# EAGLE design Side_LongE (EAGLE 9.4.2)
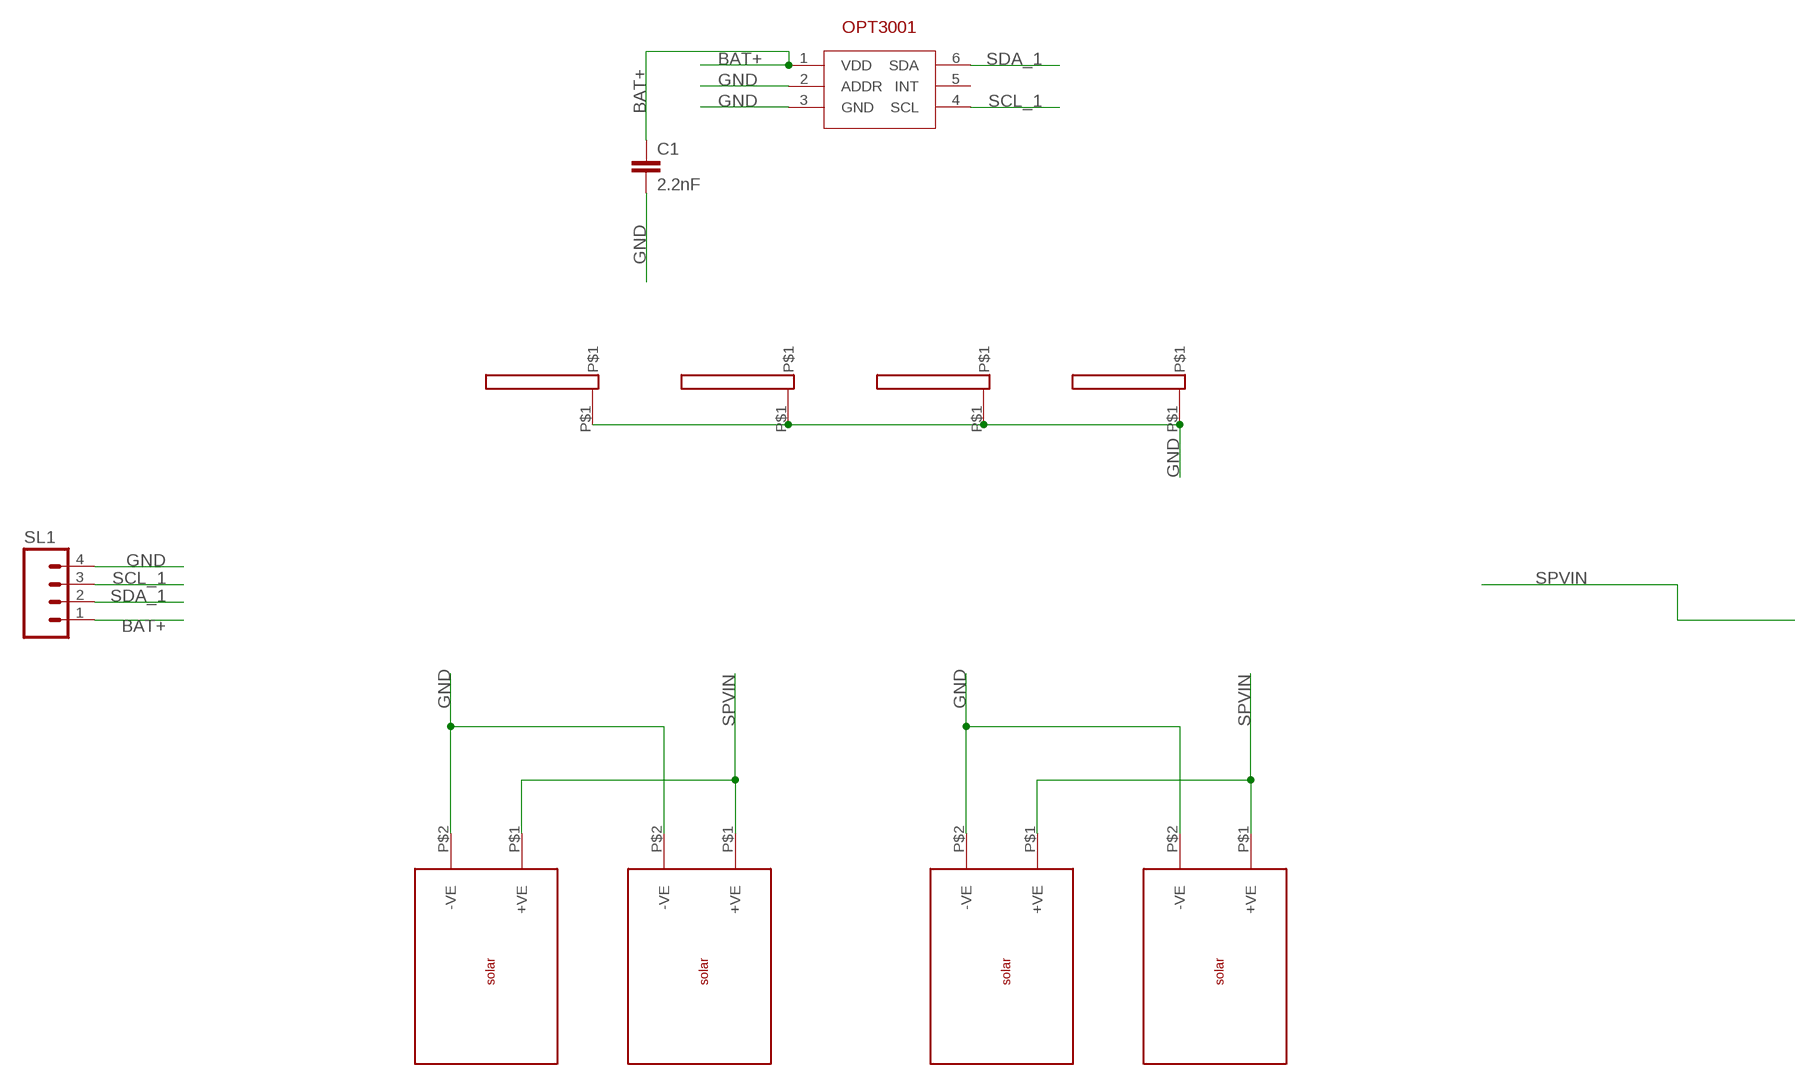
[diagram p0: schematic, sheet 1, part 1 of 2]
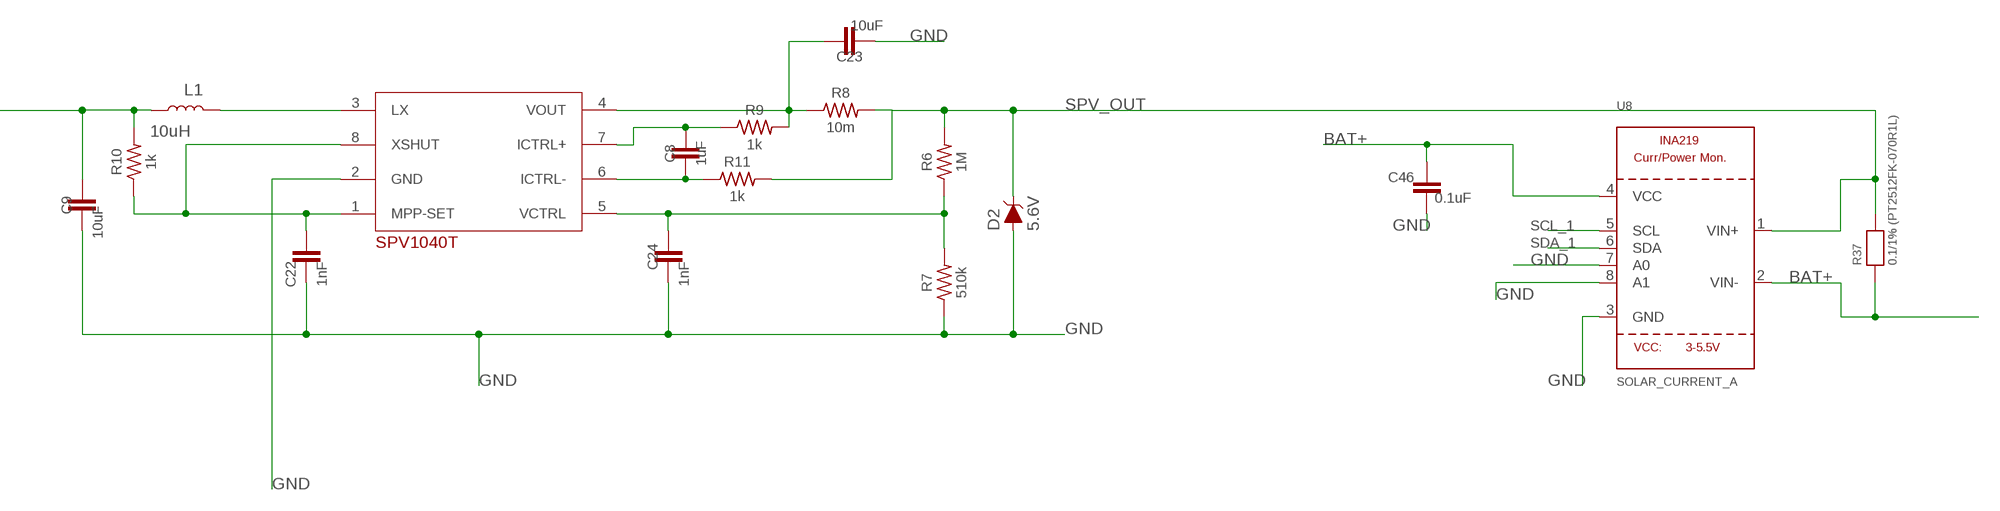
[diagram p1: schematic, sheet 1, part 2 of 2]

## Parts
C1  2.2nF  2.2NF/2200PF-0603-50V-10%  [0603]
C8  1uF  10UF-0603-6.3V-20%  [0603]
C9  10uF  10UF-0603-6.3V-20%  [0603]
C22  1nF  10UF-0603-6.3V-20%  [0603]
C23  10uF  10UF-0603-6.3V-20%  [0603]
C24  1nF  10UF-0603-6.3V-20%  [0603]
C46  0.1uF  10UF-0603-6.3V-20%  [0603]
D2  5.6V  DIODE-ZENER-MMSZ5232BS  [SOD-323]
L1  10uH  INDUCTOR-0603-33NH  [0603]
R6  1M  RC0603JR-070RL  [RES_0603]
R7  510k  RC0603JR-070RL  [RES_0603]
R8  10m  RC0603JR-070RL  [RES_0603]
R9  1k  RC0603JR-070RL  [RES_0603]
R10  1k  RC0603JR-070RL  [RES_0603]
R11  1k  RC0603JR-070RL  [RES_0603]
R37  0.1/1% (PT2512FK-070R1L)  RESISTOR2512  [2512]
SL1  M04  [04P]
SPV_A  SPV1040T_  [SOP65P640X120-8N]
U1  SON65P200X200X65-7N  [SON65P200X200X65-7N]
U8  SOLAR_CURRENT_A  INA219  [SOT23-8]
U$1  SOLAR_50_5_2  [FOOT]
U$2  SOLAR_50_5_2  [FOOT]
U$3  16X2  [16X2]
U$4  16X2  [16X2]
U$5  16X2  [16X2]
U$6  16X2  [16X2]
U$7  SOLAR_50_5_2  [FOOT]
U$8  SOLAR_50_5_2  [FOOT]

## Nets
BAT+: C1.1 C46.1 R37.1 SL1.1 U1.1(VDD) U8.2(VIN-) U8.4(VCC)
GND [vcc]: C1.2 C9.2 C22.2 C23.2 C24.2 C46.2 D2.A R7.1 SL1.4 SPV_A.2(GND) U1.2(ADDR) U1.3(GND) U8.3(GND) U8.7(A0) U8.8(A1) U$1.P$2(-VE) U$2.P$2(-VE) U$3.P$1 U$4.P$1 U$5.P$1 U$6.P$1 U$7.P$2(-VE) U$8.P$2(-VE)
N$5: L1.2 SPV_A.3(LX)
N$31: C22.1 R10.1 SPV_A.1(MPP-SET) SPV_A.8(XSHUT)
N$32: C24.1 R6.1 R7.2 SPV_A.5(VCTRL)
N$34: C8.2 R11.1 SPV_A.6(ICTRL-)
N$35: C8.1 R9.1 SPV_A.7(ICTRL+)
N$36: C23.1 R8.1 R9.2 SPV_A.4(VOUT)
SCL_1: SL1.3 U1.4(SCL) U8.5(SCL)
SDA_1: SL1.2 U1.6(SDA) U8.6(SDA)
SPV_OUT: D2.C R6.2 R8.2 R11.2 R37.2 U8.1(VIN+)
SPVIN: C9.1 L1.1 R10.2 U$1.P$1(+VE) U$2.P$1(+VE) U$7.P$1(+VE) U$8.P$1(+VE)
Unconnected: U1.5(INT)

## Library data of the parts
C1 = SparkFun-Capacitors:2.2NF/2200PF: 2.2nF/2,200pF ceramic capacitors A capacitor is a passive two-terminal electrical component used to store electrical energy temporarily in an electric field.; PROD_ID: CAP-07877
C8 C22 C24 C46 = SparkFun-Capacitors:10UF: 10.0µF ceramic capacitors A capacitor is a passive two-terminal electrical component used to store electrical energy temporarily in an electric field.; PROD_ID: CAP-11015; VALUE: 10uF
C9 C23 = SparkFun-Capacitors:10UF: 10.0µF ceramic capacitors A capacitor is a passive two-terminal electrical component used to store electrical energy temporarily in an electric field.; PROD_ID: CAP-11015
D2 = SparkFun-DiscreteSemi:DIODE-ZENER: Zener Diode A Zener diode allows current to flow from its anode to its cathode like a normal semiconductor diode, but it also permits current to flow in the reverse direction when its "Zener voltage" is reached. - WIkipedia; PROD_ID: DIO-12442
L1 = SparkFun-Coils:INDUCTOR: Inductors Resist changes in electrical current. Basically a coil of wire. SparkFun Products: SparkFun Load Cell Amplifier - HX711 <https://www.sparkfun.com/products/13879> IOIO-OTG - V2.2 <https://www.sparkfun.com/products/13613>; PROD_ID: NDUC-07874; VALUE: 33nH/±5%/500mA
R6-R11 = Resistor_Capacitor:RC0603JR-070RL: RES SMD 0 OHM JUMPER 1/10W 0603 Manufacturer's datasheet <http://www.yageo.com/documents/recent/PYu-RC_Group_51_RoHS_L_10.pdf>; CREATED_BY: PCBLayout.com; DIGIKEY_PART_NUMBER: 311-0.0GRTR-ND; MANUFACTURER: Yageo; MPN: RC0603JR-070RL; PACKAGE: SMD 0603
R37 = microbuilder:RESISTOR: Resistors 0402 - 0402 Surface Mount Package 22 Ohm 1% 1/16W [Digikey: 311-22.0LRTR-ND] 33 Ohm 5% 1/16W 1.0K 5% 1/16W 1.5K 5% 1/16W 2.0K 1% 1/16W 10.0K 1% 1/16W [Digikey: 311-10.0KLRTR-ND] 10.0K 5% 1/16W [Digikey: RMCF0402JT10K0TR-ND] 12.1K 1% 1/16W [Digikey: 311-22.0LRTR-ND] 100.0K 5% 1/16W 0603 - 0603 Surface Mount Package 0 Ohm 1/10 Watt 1% Resistor 15 Ohm 1/10 Watt 1% Resistor 33 Ohm 1/10 Watt 1% Resistor 49.9 Ohm 1/10 Watt 1% Resistor 100 Ohm 1/10 Watt 1% Resistor 150 Ohm 1/10 Watt 1% Resistor 240 Ohm 1/10 Watt 1% Resistor 390 Ohm 1/10 Watt 1% Resistor 560 Ohm 1/10 Watt 1% Resistor 680 Ohm 1/10 Watt 1% Resistor 750 Ohm 1/10 Watt 1% Resistor 1.0K Ohm 1/10 Watt 1% Resistor 1.5K Ohm 1/10 Watt 1% Resistor 2.0K Ohm 1/10 Watt 1% Resistor 2.2K Ohm 1/10 Watt 1% Resistor 3.3K Ohm 1/10 Watt 1% Resistor 4.7K Ohm 1/10 Watt 1% Resistor 10.0K Ohm 1/10 Watt 1% Resistor 12.0K Ohm 1/10 Watt 1% Resistor 12.1K Ohm 1/10 Watt 1% Resistor 20.0K Ohm 1/10 Watt 1% Resistor 33.0K Ohm 1/10 Watt 1% Resistor 100.0K Ohm 1/10 Watt 1% Resistor 0805 - 0805 Surface Mount Package 0 Ohm 1/8 Watt 1% Resistor 33 Ohm 1/8 Watt 1% Resistor 100 Ohm 1/8 Watt 1% Resistor 150 Ohm 1/8 Watt 1% Resistor 200 Ohm 1/8 Watt 1% Resistor 240 Ohm 1/8 Watt 1% Resistor 330 Ohm 1/8 Watt 1% Resistor 390 Ohm 1/8 Watt 1% Resistor 470 Ohm 1/8 Watt 1% Resistor 1.0K Ohm 1/8 Watt 1% Resistor 1.5K Ohm 1/8 Watt 1% Resistor 2.0K Ohm 1/8 Watt 1% Resistor 4.7K Ohm 1/8 Watt 1% Resistor 5.1K Ohm 1/8 Watt 1% Resistor 5.6K Ohm 1/8 Watt 1% Resistor 10.0K Ohm 1/8 Watt 1% Resistor 22.0K Ohm 1/8 Watt 1% Resistor 33.0K Ohm 1/8 Watt 1% Resistor 100K Ohm 1/8 Watt 1% Resistor 1206 - 1206 Surface Mount Package 2012 - 2010 Surface Mount Package 0.11 Ohm 1/2 Watt 1% Resistor - Digikey: RHM.11UCT-ND
SL1 = con-amp-quick:M04: AMP QUICK CONNECTOR; OC_FARNELL: unknown; OC_NEWARK: unknown
SPV_A = SPV1040T:SPV1040T_
U1 = SON65P200X200X65-7N:SON65P200X200X65-7N; A_MAX: 0.65; B_MAX: 0.3; B_MIN: 0.2; B_NOM: 0.25; D2_NOM: 1.35; D_MAX: 2.075; D_MIN: 1.925; D_NOM: 2.0; E2_NOM: 0.65; ENOM: 0.65; E_MAX: 2.075; E_MIN: 1.925; E_NOM: 2.0; L_MAX: 0.35; L_MIN: 0.25; L_NOM: 0.3; MANUFACTURER: Maxim Integrated; PIN_COUNT: 6.0; SNAPEDA_PACKAGE_ID: 71138; STANDARD: IPC 7351B
U8 = microbuilder:INA219: INA219 - I2C Current/Power Monitor Voltage Range: 0-26V Accuracy: 0.5% Temperature: -40°C - 125°C
U$1 U$2 U$7 U$8 = solar_50_5_2:SOLAR_50_5_2
U$3-U$6 = 16x2PAD:16X2: Pad for 90 degree solder

## Net classes
1 vcc: width 0.254 mm

## Board
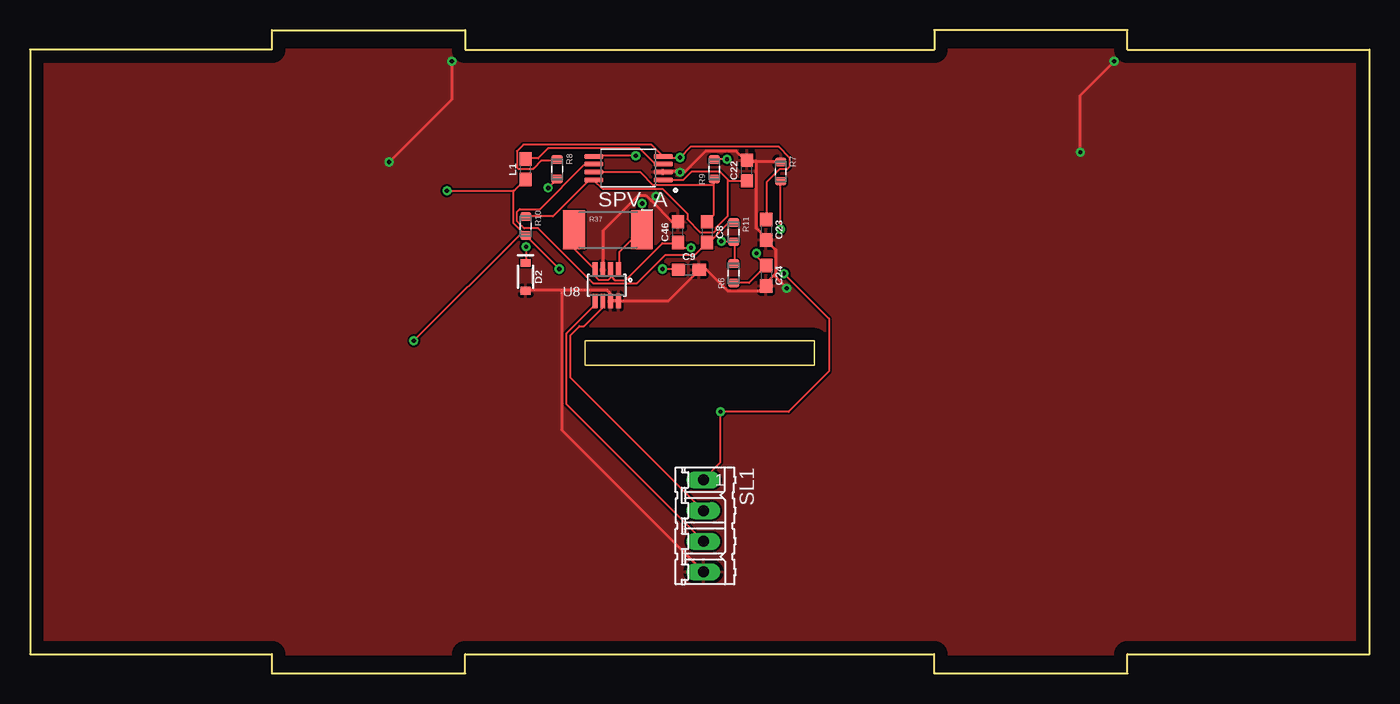
[diagram p2: board, top side]
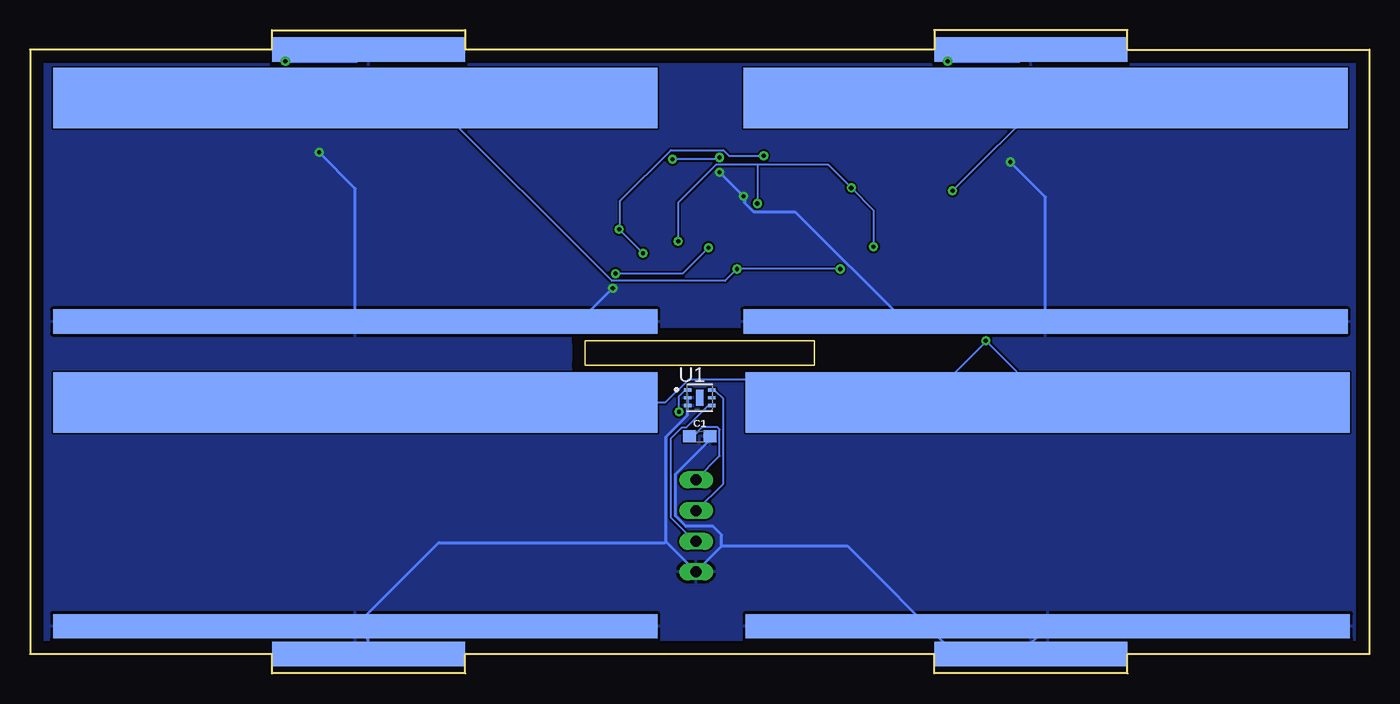
[diagram p3: board, bottom side, seen from below]

Size 110.8 x 53.2 mm. Coordinates in mm from the lower left corner, seen from the top.
Outline: 0,1.6 20,1.6 20,0 36,0 36,1.6 74.8,1.6 74.8,0 90.8,0 90.8,1.6 110.8,1.6 110.8,51.6 90.8,51.6 90.8,53.2 74.8,53.2 74.8,51.6 36,51.6 36,53.2 20,53.2 20,51.6 0,51.6 0,1.6
Outline: 64.9,27.5 45.9,27.5 45.9,25.5 64.9,25.5 64.9,27.5
Copper layers (1*16): Top 0.035mm / dielectric 1.5mm / Bottom 0.035mm
Design rules "default *": minimum track width 6mil, minimum drill 0.35mm, track to track 6mil, track to pad 6mil, pad to pad 6mil, via to via 6mil, smd to smd 6mil, copper to edge 40mil, drill to drill 6mil, minimum pad ring 10mil, minimum via ring 8mil, stop-mask expansion 4mil, vias tented up to drill 0mil, thermal gap 10mil

### Footprints (pad centres in the part's own frame; a part is rotated, then mirrored left to right if it is on the bottom)
0603 = smd 1.1 x 1: 1 -0.85,0; 2 0.85,0
SOD-323 = smd 0.63 x 0.83: A 1.15,0; C -1.15,0
RES_0603 = smd 0.74 x 0.93: 1 -0.795,0; 2 0.795,0
2512 = smd 1.8 x 3.2: 1 -2.8,0; 2 2.8,0
04P = drill 0.914 long: 1 -3.81,0; 2 -1.27,0; 3 1.27,0; 4 3.81,0
SOP65P640X120-8N = smd 1.56 x 0.41: 1 -2.88,0.975; 2 -2.88,0.325; 3 -2.88,-0.325; 4 -2.88,-0.975; 5 2.88,-0.975; 6 2.88,-0.325; 7 2.88,0.325; 8 2.88,0.975
SON65P200X200X65-7N = smd 0.72 x 0.27: 1 -0.995,0.65; 2 -0.995,0; 3 -0.995,-0.65; 4 0.995,-0.65; 5 0.995,0; 6 0.995,0.65 | smd 0.65 x 1.35: 7 0,0
SOT23-8 = smd 0.4 x 1.2: 1 -0.975,-1.3; 2 -0.325,-1.3; 3 0.325,-1.3; 4 0.975,-1.3; 5 0.975,1.3; 6 0.325,1.3; 7 -0.325,1.3; 8 -0.975,1.3
FOOT = smd 50 x 5: P$1 0,0 | smd 50 x 2: P$2 0,18.5
16X2 = smd 16 x 2: P$1 0,0

### Placement (x,y rotation side)
C1  55.4,19.6 0 bottom
C8  56,36.5 270 top
C9  54.5,33.4 0 top
C22  59.3,41.6 90 top
C23  60.9,36.7 270 top
C24  60.9,32.9 270 top
C46  53.6,36.5 90 top
D2  41,32.8 270 top
L1  41,41.7 90 top
R6  58.2,33.1 90 top
R7  420k  [RES_0603]  62.1,41.5 270 top
R8  43.6,41.7 270 top
R9  56.6,41.7 90 top
R10  41,37 270 top
R11  58.2,36.5 270 top
R37  47.8,36.7 0 top
SL1  55.7,12.2 270 top
SPV_A  49.5,41.8 180 top
U1  55.4,22.8 0 bottom
U8  47.7,32.1 180 top
U$1  26.8,47.6 180 bottom
U$2  26.6,22.4 180 bottom
U$3  28,1.6 0 bottom
U$4  82.8,1.6 0 bottom
U$5  28,51.6 0 bottom
U$6  82.8,51.6 0 bottom
U$7  83.9,47.6 180 bottom
U$8  83.9,22.4 180 bottom

### Tracks (layer width: path | path; a pad name or v marks a point on that pad's centre or on a via)
BAT+  (via drill 0.35)
  Top 0.152: SL1.1 55.74,16.08 57.11,17.45 v57.11,21.64 62.75,21.64 66.1,24.99 66.1,29.34 v62.37,33.07 | 48.08,32.8 48.04,32.84 48.04,33.38 U8.2 | 48.08,32.8 48.35,32.54 49.26,32.54 52.31,35.59 53.53,35.59 C46.1 53.61,35.59 53.99,35.2 v54.67,35.2 | 48.08,32.8 47.81,32.54 47.05,32.54 46.75,32.84 46.75,33.38 U8.4 46.67,33.45 45.07,35.05 45.07,36.65 R37.1
  Bottom 0.152: v57.11,21.64 57.11,22.94 56.65,23.39 56.43,23.39 U1.1 | C1.1 56.2,19.66 55.89,19.66 55.21,20.35 53.91,20.35 53.76,20.19 53.76,17.98 55.66,16.08 SL1.1 | v62.37,33.07 56.81,33.07 v54.67,35.2
GND  (via drill 0.35)
  Top 0.254: 51.4,39.09 50.94,39.55 50.33,39.55 47.43,36.65 47.43,33.45 U8.3 | 51.4,39.09 53.07,37.41 53.53,37.41 C46.2 | 60.08,42.37 59.4,42.37 59.32,42.44 C22.2 59.17,42.44 58.41,43.2 55.89,43.2 54.22,41.53 53.76,41.53 | 60.08,42.37 62.06,42.37 R7.1 | 53.76,41.53 52.39,41.53 SPV_A.2 | 44,31.7 47.74,31.7 47.97,31.47 47.97,30.86 U8.7 48.12,30.86 48.65,30.86 U8.8 48.81,30.79 52.77,30.79 55.28,33.3 C9.2 55.36,33.38 55.97,33.38 57.72,31.62 60.31,31.62 60.77,32.08 C24.2 60.92,32.08 60.92,32.31 61.53,32.92 | 44,31.7 41.03,31.7 D2.A | 61.53,32.92 61.68,33.07 61.68,35.05 60.92,35.81 C23.2 60.92,35.97 60.08,36.8 60.08,42.37 | v51.78,39.47 51.4,39.09 | v53.76,41.45 53.76,41.53 | 44,31.7 44,20.12 55.66,8.46 SL1.4 | 61.53,32.92 v62.6,31.85 | v29.7,42.3 34.89,47.49 v34.89,50.63 | v86.9,43.1 86.9,47.84 v89.69,50.63
  Bottom 0.254: 27.93,1.97 27.93,2.59 26.63,3.89 U$2.P$2 | 27.93,1.97 27.93,1.6 U$3.P$1 | v53.76,41.45 v51.78,39.47 51.7,39.4 51.7,38.94 50.94,38.18 47.51,38.18 38.44,29.11 26.86,29.11 U$1.P$2 26.8,39.4 v29.7,42.3 | U1.2 56.43,22.78 56.43,22.17 U1.3 56.43,22.02 56.43,21.34 58.18,19.58 58.18,10.9 | 58.18,10.9 55.74,8.46 SL1.4 53.59,10.51 53.59,10.54 | 53.59,10.54 53.59,11.45 54.3,12.16 56.55,12.16 57.42,13.03 57.42,16.46 54.6,19.28 54.6,19.58 C1.2 | 58.18,10.9 58.25,10.82 77,10.82 83.86,3.96 U$8.P$2 83.86,3.81 82.87,2.82 82.87,1.6 U$4.P$1 | 27.93,1.97 34.62,1.97 43.19,10.54 53.59,10.54 | v62.6,31.85 65.34,29.11 83.86,29.11 U$7.P$2 83.9,40.1 v86.9,43.1 | v34.89,50.63 28.97,50.63 U$5.P$1 | v89.69,50.63 83.77,50.63 U$6.P$1
  pour Bottom: 0,1.6 0,51.6 110.8,51.6 110.8,1.6
  pour Top: 0,1.6 0,51.6 110.8,51.6 110.8,1.6
N$5
  Top 0.152: L1.2 41.03,42.6 42.02,42.6 42.86,43.43 50.41,43.43 51.7,42.14 52.31,42.14 SPV_A.3
N$31
  Top 0.152: 57.76,40.8 57.03,41.53 54.75,41.53 54.06,40.84 52.39,40.84 SPV_A.1 | 57.76,40.8 57.8,40.77 59.24,40.77 C22.1 | R10.1 43.24,37.8 46.21,40.77 46.6,40.77 SPV_A.8 46.67,40.77 47.36,40.08 52.31,40.08 54.37,38.02 54.37,37.57 55.43,36.5 56.58,36.5 56.73,36.65 56.73,36.88 57.72,37.87 57.72,40.77 57.76,40.8
N$32  (via drill 0.35)
  Top 0.152: R6.1 58.25,32.31 59.47,32.31 60.84,33.68 C24.1 60.84,33.76 60.08,34.52 v60.08,34.75 | v62.06,36.73 62.06,40.69 R7.2 | v50.1,42.82 46.67,42.82 SPV_A.5
  Bottom 0.152: v60.08,34.75 v62.06,36.73 61.99,36.73 61.99,39.09 57.8,43.28 53.45,43.28 53,42.82 v50.1,42.82
N$34
  Top 0.152: R11.1 58.18,37.26 57.8,37.26 56.2,35.66 56.05,35.66 C8.2 55.97,35.59 54.98,34.59 52.54,34.59 50.18,32.23 46.6,32.23 42.02,36.8 40.88,36.8 40.27,37.41 40.27,38.18 40.5,38.41 42.18,38.41 45.83,42.06 46.6,42.06 SPV_A.6
N$35
  Top 0.152: 56.58,40.39 56.58,37.95 56.05,37.41 C8.1 | 56.58,40.39 56.58,40.84 R9.1 | 56.58,40.39 51.55,40.39 50.48,41.45 46.67,41.45 SPV_A.7
N$36  (via drill 0.35)
  Top 0.152: R8.1 43.55,42.44 42.33,42.44 41.64,41.76 40.35,41.76 40.27,41.83 40.27,43.2 40.8,43.74 51.4,43.74 52.31,42.82 SPV_A.4 52.39,42.75 52.46,42.67 v53.76,42.67 54.67,43.59 61.91,43.59 62.83,42.67 62.83,41.91 62.6,41.68 61.99,41.68 60.92,40.61 60.92,37.57 C23.1 | v57.64,42.52 56.65,42.52 R9.2
  Bottom 0.152: v57.64,42.52 53.91,42.52 v53.76,42.67
SCL_1
  Top 0.152: U8.5 46.67,30.79 46.67,30.4 44.39,28.12 44.39,22.25 55.66,10.97 SL1.3
  Bottom 0.152: U1.4 54.45,22.1 54.75,22.1 56.5,20.35 56.88,20.35 57.8,19.43 57.8,12.88 55.89,10.97 55.74,10.97 SL1.3
SDA_1
  Top 0.152: U8.6 47.36,30.79 47.36,30.25 45.83,28.73 45.45,28.73 44.69,27.96 44.69,24.46 55.66,13.49 SL1.2
  Bottom 0.152: U1.6 54.37,23.39 54.14,23.39 53.45,22.71 53.45,15.7 55.66,13.49 SL1.2
SPV_OUT  (via drill 0.35)
  Top 0.152: U8.1 48.73,33.45 48.73,34.82 50.56,36.65 R37.2 50.63,36.73 v50.63,38.86 | R6.2 58.25,33.91 58.25,35.66 R11.2 58.18,35.74 v57.19,35.74 | v41.03,35.28 41.03,33.98 D2.C | v42.86,40.16 43.55,40.84 R8.2
  Bottom 0.152: v41.03,35.28 41.03,38.33 v42.86,40.16 44.77,42.06 50.63,42.06 | v57.19,35.74 57.19,38.94 54.06,42.06 50.63,42.06 | 50.63,42.06 v50.63,38.86
SPVIN  (via drill 0.35)
  Top 0.152: 40.73,36.5 39.97,37.26 39.97,39.85 40,39.89 | 40.73,36.5 40.96,36.27 R10.2 | 40,39.89 40.96,40.84 L1.1 | v52.31,33.45 53.61,33.45 C9.1 | v43.78,33.45 41.03,36.2 R10.2 | v34.48,39.93 39.97,39.93 40,39.89 | 40.73,36.5 v31.74,27.51 | 40.73,36.5 R10.2
  Bottom 0.152: v43.78,33.45 v52.31,33.45 53.3,32.46 62.67,32.46 77.76,47.55 83.86,47.55 U$7.P$1 | v34.48,39.93 26.86,47.55 U$1.P$1 | U$2.P$1 26.63,22.4 v31.74,27.51 31.74,27.43 34.86,24.31 56.35,24.31 58.25,22.4 83.86,22.4 U$8.P$1